# EAGLE design coba (EAGLE 9.6.1)
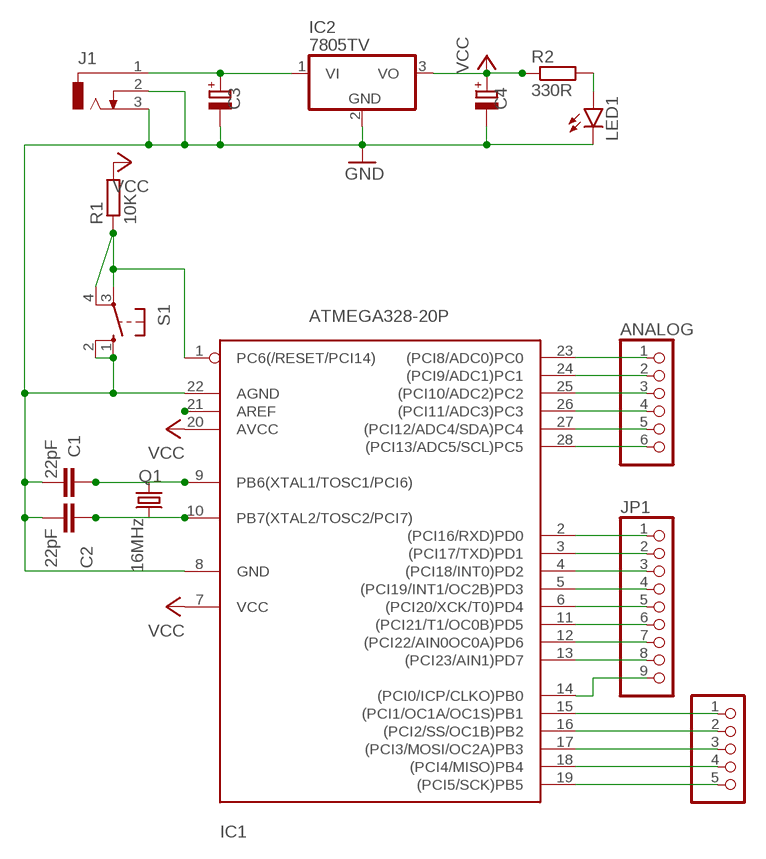
[diagram p0: schematic, sheet 1]

## Parts
ANALOG  PINHD-1X6  [1X06]
C1  22pF  C-EU025-024X044  [C025-024X044]
C2  22pF  C-EU025-024X044  [C025-024X044]
C3  CPOL-EUE2.5-6  [E2,5-6]
C4  CPOL-EUE2.5-6  [E2,5-6]
DIGITAL2  PINHD-1X5  [1X05]
IC1  ATMEGA328-20P  [DIL28-3]
IC2  7805TV  [TO220V]
J1  DCJ0303  [DCJ0303]
JP1  PINHD-1X9  [1X09]
LED1  LED3MM  [LED3MM]
Q1  16MHz  CRYSTALHC49U70  [HC49U70]
R1  10K  R-EU_0207/10  [0207/10]
R2  330R  R-EU_0207/10  [0207/10]
S1  10-XX  [B3F-10XX]

## Nets
ANALOG: ANALOG.2 IC1.24((PCI9/ADC1)PC1)
GND: C1.2 C2.2 C3.- C4.- IC1.8(GND) IC1.22(AGND) IC2.2(GND) J1.2 J1.3 LED1.K(C) S1.1(S) S1.2(S1)
N$2: C1.1 IC1.9(PB6(XTAL1/TOSC1/PCI6)) Q1.1
N$3: C2.1 IC1.10(PB7(XTAL2/TOSC2/PCI7)) Q1.2
N$5: ANALOG.1 IC1.23((PCI8/ADC0)PC0)
N$6: C3.+ IC2.1(VI) J1.1
N$7: ANALOG.3 IC1.25((PCI10/ADC2)PC2)
N$8: ANALOG.4 IC1.26((PCI11/ADC3)PC3)
N$9: ANALOG.5 IC1.27((PCI12/ADC4/SDA)PC4)
N$10: ANALOG.6 IC1.28((PCI13/ADC5/SCL)PC5)
N$11: IC1.2((PCI16/RXD)PD0) JP1.1
N$12: IC1.3((PCI17/TXD)PD1) JP1.2
N$13: IC1.4((PCI18/INT0)PD2) JP1.3
N$14: IC1.5((PCI19/INT1/OC2B)PD3) JP1.4
N$15: IC1.6((PCI20/XCK/T0)PD4) JP1.5
N$16: IC1.11((PCI21/T1/OC0B)PD5) JP1.6
N$17: IC1.12((PCI22/AIN0OC0A)PD6) JP1.7
N$18: IC1.13((PCI23/AIN1)PD7) JP1.8
N$19: DIGITAL2.1 IC1.15((PCI1/OC1A/OC1S)PB1)
N$20: DIGITAL2.2 IC1.16((PCI2/SS/OC1B)PB2)
N$21: DIGITAL2.3 IC1.17((PCI3/MOSI/OC2A)PB3)
N$22: DIGITAL2.4 IC1.18((PCI4/MISO)PB4)
N$23: DIGITAL2.5 IC1.19((PCI5/SCK)PB5)
N$24: IC1.14((PCI0/ICP/CLKO)PB0) JP1.9
N$25: LED1.A R2.2
VCC: C4.+ IC1.1(PC6(/RESET/PCI14)) IC1.7(VCC) IC1.20(AVCC) IC1.21(AREF) IC2.3(VO) R1.1 R1.2 R2.1 S1.3(P) S1.4(P1)

## Library data of the parts
ANALOG = pinhead:PINHD-1X6: PIN HEADER
C1 C2 = rcl:C-EU: CAPACITOR, European symbol; SPICEPREFIX: C
C3 C4 = rcl:CPOL-EU: POLARIZED CAPACITOR, European symbol; SPICEPREFIX: C
DIGITAL2 = pinhead:PINHD-1X5: PIN HEADER
IC1 = atmega328:ATMEGA328*P: MICROCONTROLLER 32 kBytes FLASH 2 kBytes SRAM 1 kBytes EEPROM USART 8-channel 10 bit ADC
IC2 = linear:78*: Positive VOLTAGE REGULATOR Source: http://cache.national.com/ds/LM/LM78L05.pdf http://www.fairchildsemi.com/ds/LM/LM7805.pdf
J1 = con-jack:DCJ0303: DC POWER JACK Source: DCJ0303.pdf; OC_FARNELL: unknown; OC_NEWARK: unknown
JP1 = pinhead:PINHD-1X9: PIN HEADER
LED1 = led:LED: LED OSRAM: - CHIPLED LG R971, LG N971, LY N971, LG Q971, LY Q971, LO R971, LY R971 LH N974, LH R974 LS Q976, LO Q976, LY Q976 LO Q996 - Hyper CHIPLED LW Q18S LB Q993, LB Q99A, LB R99A - SideLED LS A670, LO A670, LY A670, LG A670, LP A670 LB A673, LV A673, LT A673, LW A673 LH A674 LY A675 LS A676, LA A676, LO A676, LY A676, LW A676 LS A679, LY A679, LG A679 - Hyper Micro SIDELED® LS Y876, LA Y876, LO Y876, LY Y876 LT Y87S - SmartLED LW L88C, LW L88S LB L89C, LB L89S, LG L890 LS L89K, LO L89K, LY L89K LS L896, LA L896, LO L896, LY L896 - TOPLED LS T670, LO T670, LY T670, LG T670, LP T670 LSG T670, LSP T670, LSY T670, LOP T670, LYG T670 LG T671, LOG T671, LSG T671 LB T673, LV T673, LT T673, LW T673 LH T674 LS T676, LA T676, LO T676, LY T676, LB T676, LH T676, LSB T676, LW T676 LB T67C, LV T67C, LT T67C, LS T67K, LO T67K, LY T67K, LW E67C LS E67B, LA E67B, LO E67B, LY E67B, LB E67C, LV E67C, LT E67C LW T67C LS T679, LY T679, LG T679 LS T770, LO T770, LY T770, LG T770, LP T770 LB T773, LV T773, LT T773, LW T773 LH T774 LS E675, LA E675, LY E675, LS T675 LS T776, LA T776, LO T776, LY T776, LB T776 LHGB T686 LT T68C, LB T68C - Hyper Mini TOPLED® LB M676 - Mini TOPLED Santana® LG M470 LS M47K, LO M47K, LY M47K Source: http://www.osram.convergy.de LUXEON: - LUMILED® LXK2-PW12-R00, LXK2-PW12-S00, LXK2-PW14-U00, LXK2-PW14-V00 LXK2-PM12-R00, LXK2-PM12-S00, LXK2-PM14-U00 LXK2-PE12-Q00, LXK2-PE12-R00, LXK2-PE12-S00, LXK2-PE14-T00, LXK2-PE14-U00 LXK2-PB12-K00, LXK2-PB12-L00, LXK2-PB12-M00, LXK2-PB14-N00, LXK2-PB14-P00, LXK2-PB14-Q00 LXK2-PR12-L00, LXK2-PR12-M00, LXK2-PR14-Q00, LXK2-PR14-R00 LXK2-PD12-Q00, LXK2-PD12-R00, LXK2-PD12-S00 LXK2-PH12-R00, LXK2-PH12-S00 LXK2-PL12-P00, LXK2-PL12-Q00, LXK2-PL12-R00 Source: www.luxeon.com KINGBRIGHT: KA-3528ASYC Source: www.kingbright.com
Q1 = crystal:CRYSTAL: CRYSTAL; OC_FARNELL: unknown; OC_NEWARK: unknown
R1 R2 = resistor:R-EU_: RESISTOR, European symbol
S1 = switch-omron:10-XX: OMRON SWITCH; MPN: B3F-1000; OC_FARNELL: 176432; OC_NEWARK: 36M3542

## Board
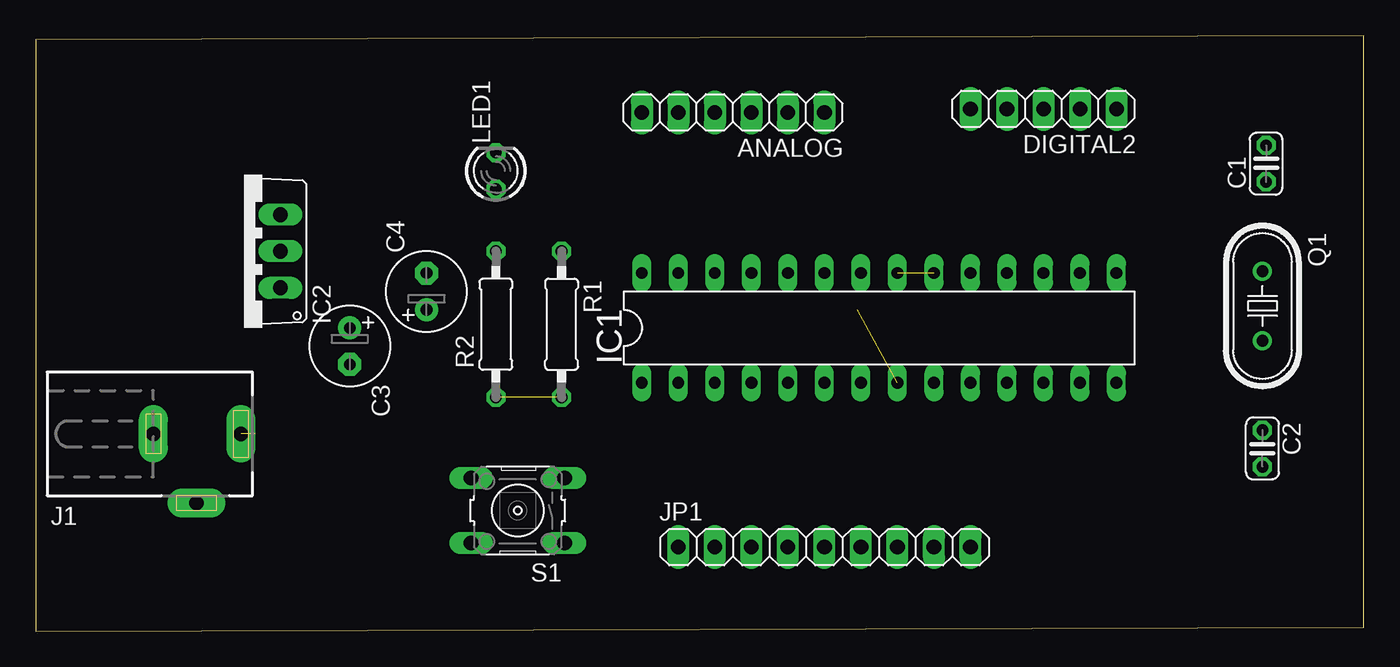
[diagram p1: board, top side]
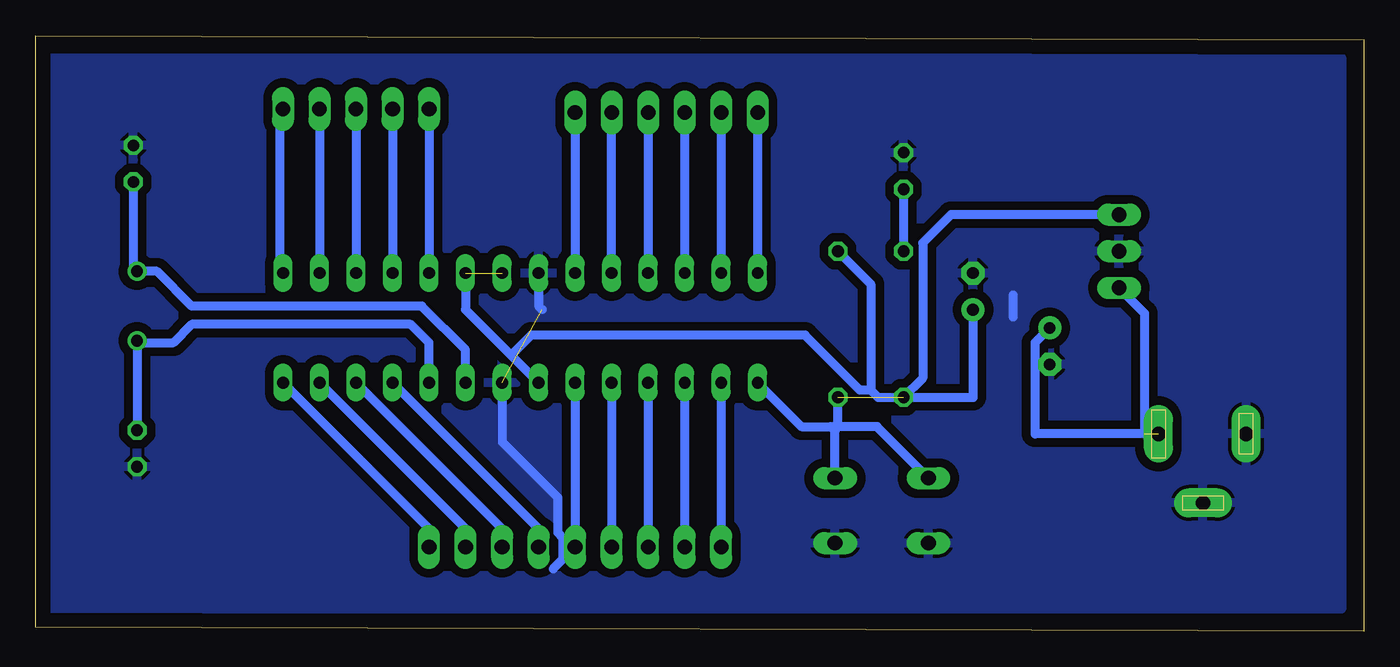
[diagram p2: board, bottom side, seen from below]

Size 92.38 x 41.39 mm. Coordinates in mm from the lower left corner, seen from the top.
Outline: 0,0 92.38,0.25 92.38,41.39 0,41.14 0,0
Copper layers (1*16): Top 0.035mm / dielectric 1.5mm / Bottom 0.035mm
Design rules "default": minimum track width 6mil, minimum drill 0.35mm, track to track 6mil, track to pad 6mil, pad to pad 6mil, via to via 6mil, smd to smd 6mil, copper to edge 40mil, drill to drill 6mil, minimum pad ring 10mil, minimum via ring 8mil, stop-mask expansion 4mil, vias tented up to drill 0mil, thermal gap 10mil

### Footprints (pad centres in the part's own frame; a part is rotated, then mirrored left to right if it is on the bottom)
1X06 = drill 1.016 long: 1 -6.35,0; 2 -3.81,0; 3 -1.27,0; 4 1.27,0; 5 3.81,0; 6 6.35,0
C025-024X044 = drill 0.813 octagon: 1 -1.27,0; 2 1.27,0
E2,5-6 = drill 0.813 pad 1.6: + -1.27,0 | drill 0.813 pad 1.6 octagon: - 1.27,0
1X05 = drill 1.016 long: 1 -5.08,0; 2 -2.54,0; 3 0,0; 4 2.54,0; 5 5.08,0
DIL28-3 = drill 0.813 long: 1 -16.51,-3.81; 2 -13.97,-3.81; 3 -11.43,-3.81; 4 -8.89,-3.81; 5 -6.35,-3.81; 6 -3.81,-3.81; 7 -1.27,-3.81; 8 1.27,-3.81; 9 3.81,-3.81; 10 6.35,-3.81; 11 8.89,-3.81; 12 11.43,-3.81; 13 13.97,-3.81; 14 16.51,-3.81; 15 16.51,3.81; 16 13.97,3.81; 17 11.43,3.81; 18 8.89,3.81; 19 6.35,3.81; 20 3.81,3.81; 21 1.27,3.81; 22 -1.27,3.81; 23 -3.81,3.81; 24 -6.35,3.81; 25 -8.89,3.81; 26 -11.43,3.81; 27 -13.97,3.81; 28 -16.51,3.81
TO220V = drill 1.016 long: 1 -2.54,-2.54; 2 0,-2.54; 3 2.54,-2.54
DCJ0303 = drill 1 pad 2 long: 1 0,3.1; 2 4.8,0; 3 0,-3
1X09 = drill 1.016 long: 1 -10.16,0; 2 -7.62,0; 3 -5.08,0; 4 -2.54,0; 5 0,0; 6 2.54,0; 7 5.08,0; 8 7.62,0; 9 10.16,0
LED3MM = drill 0.813 octagon: A -1.27,0; K 1.27,0
HC49U70 = drill 0.813: 1 -2.413,0; 2 2.413,0
0207/10 = drill 0.813 octagon: 1 -5.08,0; 2 5.08,0
B3F-10XX = drill 1.016 long: 1 -3.251,2.261; 2 3.251,2.261; 3 -3.251,-2.261; 4 3.251,-2.261

### Placement (x,y rotation side)
ANALOG  48.51,36.07 180 top
C1  85.6,32.51 90 top
C2  85.34,12.7 270 top
C3  21.84,19.81 270 top
C4  27.18,23.62 90 top
DIGITAL2  70.1,36.32 180 top
IC1  58.67,21.08 0 top
IC2  14.48,26.42 90 top
J1  11.18,13.72 270 top
JP1  54.86,5.84 0 top
LED1  32,32 90 top
Q1  85.34,22.61 270 top
R1  36.58,21.34 270 top
R2  32,21.34 90 top
S1  33.53,8.38 180 top

### Tracks (layer width: path | path; a pad name or v marks a point on that pad's centre or on a via)
ANALOG
  Bottom 0.61: IC1.24 ANALOG.2
GND  (1 unrouted)
  Bottom 0.61: IC1.8 59.94,13.15 56.08,9.29 56.08,6.86 55.73,6.5 55.73,4.98 56.39,4.32 | 24.38,23.37 24.38,21.84 | IC1.22 57.4,22.61 57.15,22.35 | S1.2 30.56,5.84
  pour Bottom (isolate 0.61): 1.52,39.88 1.52,1.52 91.19,1.52 91.19,39.88
N$2
  Bottom 0.61: IC1.9 62.48,19.56 65.53,22.61 81.53,22.61 83.95,25.02 Q1.1 85.6,25.27 C1.1
N$3
  Bottom 0.61: IC1.10 65.02,20.07 66.29,21.34 81.53,21.34 82.8,20.07 85.22,20.07 Q1.2 C2.1
N$5
  Bottom 0.61: ANALOG.1 IC1.23
N$6  (1 unrouted)
  Bottom 0.61: J1.1 22.86,13.72 22.86,20.07 C3.+ | IC2.1 15.24,22.1 15.24,13.72
N$7
  Bottom 0.61: ANALOG.3 IC1.25
N$8
  Bottom 0.61: ANALOG.4 IC1.26
N$9
  Bottom 0.61: ANALOG.5 IC1.27
N$10
  Bottom 0.61: ANALOG.6 IC1.28
N$11
  Bottom 0.61: IC1.2 JP1.1
N$12
  Bottom 0.61: IC1.3 JP1.2
N$13
  Bottom 0.61: IC1.4 JP1.3
N$14
  Bottom 0.61: IC1.5 JP1.4
N$15
  Bottom 0.61: IC1.6 JP1.5
N$16
  Bottom 0.61: 57.66,5.84 JP1.6 57.4,7.11 IC1.11
N$17
  Bottom 0.61: IC1.12 59.94,7.11 JP1.7
N$18
  Bottom 0.61: JP1.8 62.48,7.11 IC1.13
N$19
  Bottom 0.61: DIGITAL2.1 75.44,36.07 75.44,24.38 75.18,24.64 IC1.15
N$20
  Bottom 0.61: DIGITAL2.2 IC1.16
N$21
  Bottom 0.61: DIGITAL2.3 IC1.17
N$22
  Bottom 0.61: DIGITAL2.4 IC1.18
N$23
  Bottom 0.61: DIGITAL2.5 IC1.19
N$24
  Bottom 0.61: IC1.14 65.02,7.11 JP1.9
N$25
  Bottom 0.61: LED1.A R2.2
VCC  (2 unrouted)
  Bottom 0.61: IC2.3 28.7,28.96 30.67,26.99 30.67,17.59 R2.1 | 34.29,16.76 33.78,16.26 R2.1 | IC1.20 62.48,22.35 59.18,19.05 | 59.18,19.05 IC1.7 | 34.29,16.76 35.05,16.76 38.86,20.57 57.91,20.57 59.18,19.3 59.18,19.05 | C4.+ 27.18,16.26 R2.1 | R1.1 34.29,24.13 34.29,16.76 | IC1.1 39.12,14.22 37.08,14.22 | 37.08,14.22 36.83,14.22 | 36.83,14.22 36.58,14.48 R1.2 | S1.3 36.78,13.92 37.08,14.22 | S1.4 33.86,14.22 36.83,14.22